# EAGLE design hbridge (EAGLE 5.11)
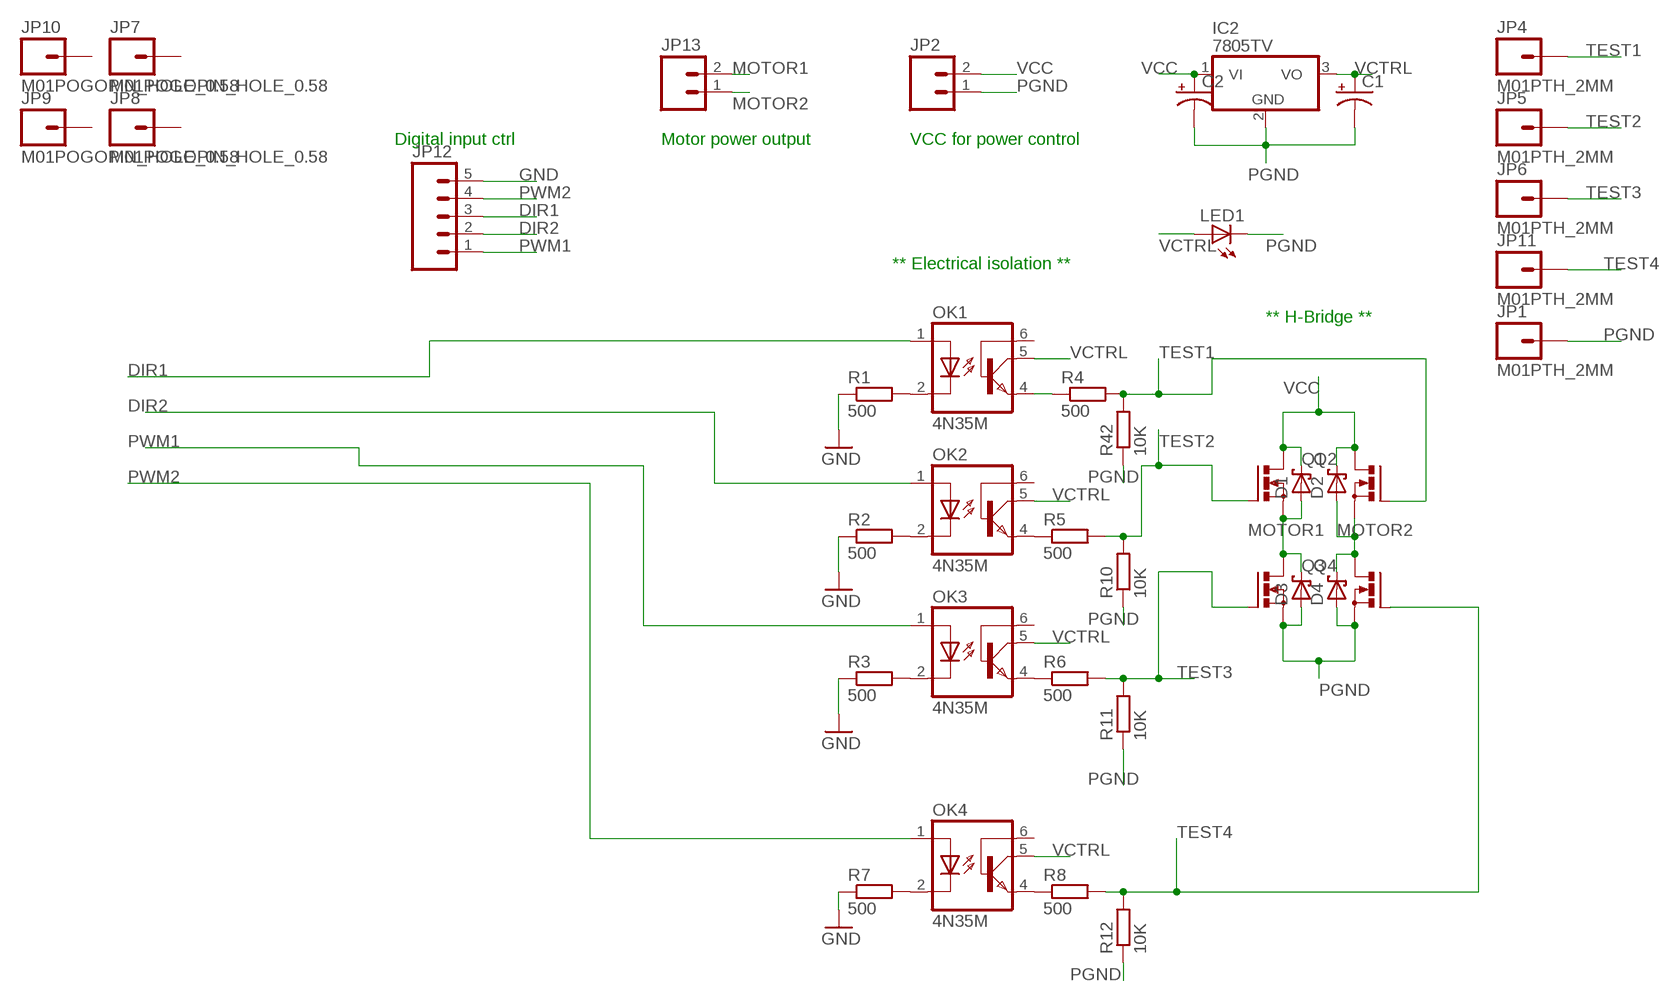
[diagram p0: schematic, sheet 1]

## Parts
C1  CAP_POLPTH2  [CPOL-RADIAL-10UF-25V]
C2  CAP_POLPTH1  [CPOL-RADIAL-100UF-25V]
D1  SCHOTTKY-DIODECB417-15  [CB417-15]
D2  SCHOTTKY-DIODECB417-15  [CB417-15]
D3  SCHOTTKY-DIODECB417-15  [CB417-15]
D4  SCHOTTKY-DIODECB417-15  [CB417-15]
IC2  7805TV  [TO220V]
JP1  M01PTH_2MM  [1X01_2MM]
JP2  M025MM  [SCREWTERMINAL-5MM-2]
JP4  M01PTH_2MM  [1X01_2MM]
JP5  M01PTH_2MM  [1X01_2MM]
JP6  M01PTH_2MM  [1X01_2MM]
JP7  M01POGOPIN_HOLE_0.58  [1X01_POGOPIN_HOLE_0.58]
JP8  M01POGOPIN_HOLE_0.58  [1X01_POGOPIN_HOLE_0.58]
JP9  M01POGOPIN_HOLE_0.58  [1X01_POGOPIN_HOLE_0.58]
JP10  M01POGOPIN_HOLE_0.58  [1X01_POGOPIN_HOLE_0.58]
JP11  M01PTH_2MM  [1X01_2MM]
JP12  M05PTH_LONGPADS  [1X05_LONGPADS]
JP13  M025MM  [SCREWTERMINAL-5MM-2]
LED1  LED5MM  [LED5MM]
OK1  4N35M  [DIL06]
OK2  4N35M  [DIL06]
OK3  4N35M  [DIL06]
OK4  4N35M  [DIL06]
Q1  PMOSFET_NTO220BV  [TO220BV]
Q2  PMOSFET_NTO220BV  [TO220BV]
Q3  PMOSFET_NTO220BV  [TO220BV]
Q4  PMOSFET_NTO220BV  [TO220BV]
R1  500  R-EU_0309/12  [0309/12]
R2  500  R-EU_0309/12  [0309/12]
R3  500  R-EU_0309/12  [0309/12]
R4  500  R-EU_0309/12  [0309/12]
R5  500  R-EU_0309/12  [0309/12]
R6  500  R-EU_0309/12  [0309/12]
R7  500  R-EU_0309/12  [0309/12]
R8  500  R-EU_0309/12  [0309/12]
R10  10K  R-EU_0309/12  [0309/12]
R11  10K  R-EU_0309/12  [0309/12]
R12  10K  R-EU_0309/12  [0309/12]
R42  10K  R-EU_0309/12  [0309/12]

## Nets
DIR1: JP12.3 OK1.1(A)
DIR2: JP12.2 OK2.1(A)
GND: JP12.5 R1.1 R2.1 R3.1 R7.1
MOTOR1: D1.A D3.C JP13.2 Q1.S Q3.D
MOTOR2: D2.A D4.C JP13.1 Q2.S Q4.D
N$1: OK1.2(C) R1.2
N$3: OK2.2(C) R2.2
N$4: OK1.4(EMI) R4.1
N$5: OK3.2(C) R3.2
N$8: OK4.2(C) R7.2
N$9: OK2.4(EMI) R5.1
N$10: OK3.4(EMI) R6.1
N$11: OK4.4(EMI) R8.1
PGND: C1.2(-) C2.2(-) D3.A D4.A IC2.2(GND) JP1.1 JP2.1 LED1.K(C) Q3.S Q4.S R10.1 R11.1 R12.1 R42.1
PWM1: JP12.1 OK3.1(A)
PWM2: JP12.4 OK4.1(A)
TEST1: JP4.1 Q2.G R4.2 R42.2
TEST2: JP5.1 Q1.G R5.2 R10.2
TEST3: JP6.1 Q3.G R6.2 R11.2
TEST4: JP11.1 Q4.G R8.2 R12.2
VCC: C2.1(+) D1.C D2.C IC2.1(VI) JP2.2 Q1.D Q2.D
VCTRL: C1.1(+) IC2.3(VO) LED1.A OK1.5(COL) OK2.5(COL) OK3.5(COL) OK4.5(COL)
Unconnected: JP7.1 JP8.1 JP9.1 JP10.1 OK1.6(BAS) OK2.6(BAS) OK3.6(BAS) OK4.6(BAS)

## Notes on the sheet
- Digital input ctrl | Motor power output | VCC for power control
- ** Electrical isolation **
- ** H-Bridge **

## Library data of the parts
C1 C2 = SparkFun:CAP_POL: Capacitor Polarized These are standard SMD and PTH capacitors. Normally 10uF, 47uF, and 100uF in electrolytic and tantalum varieties. Always verify the external diameter of the through hole cap, it varies with capacity, voltage, and manufacturer. The EIA devices should be standard.
D1-D4 = adafruit:SCHOTTKY-DIODE: Schottky Diode
IC2 = linear:78*: Positive VOLTAGE REGULATOR Source: http://cache.national.com/ds/LM/LM78L05.pdf http://www.fairchildsemi.com/ds/LM/LM7805.pdf
JP1 JP4-JP11 = SparkFun:M01: Header 1 Standard 1-pin 0.1" header. Use with straight break away headers (SKU : PRT-00116), right angle break away headers (PRT-00553), swiss pins (PRT-00743), machine pins (PRT-00117), and female headers (PRT-00115).
JP2 JP13 = SparkFun:M02: Header 2 Standard 2-pin 0.1" header. Use with straight break away headers (SKU : PRT-00116), right angle break away headers (PRT-00553), swiss pins (PRT-00743), machine pins (PRT-00117), and female headers (PRT-00115). Molex polarized connector foot print use with SKU : PRT-08233 with associated crimp pins and housings.
JP12 = SparkFun:M05: Header 5 Standard 5-pin 0.1" header. Use with straight break away headers (SKU : PRT-00116), right angle break away headers (PRT-00553), swiss pins (PRT-00743), machine pins (PRT-00117), and female headers (PRT-00115). Molex polarized connector foot print use with SKU : PRT-08230 with associated crimp pins and housings.
LED1 = SparkFun:LED: LEDs Standard schematic elements and footprints for 5mm, 3mm, 1206, and 0603 sized LEDs. 5mm - Spark Fun Electronics SKU : COM-00529 (and others)
OK1-OK4 = optocoupler:4N*?M: General Purpose 6-Pin Phototransistor Optocouplers Source: http://www.fairchildsemi.com/ds/4N/4N35-M.pdf; MPN: 4N35-M; OC_FARNELL: 1021351; OC_NEWARK: 98K9114
Q1-Q4 = transistor-power:PMOSFET_N: Power MOSFET N-Channel
R1-R8 R10-R12 R42 = rcl:R-EU_: RESISTOR, European symbol

## Board
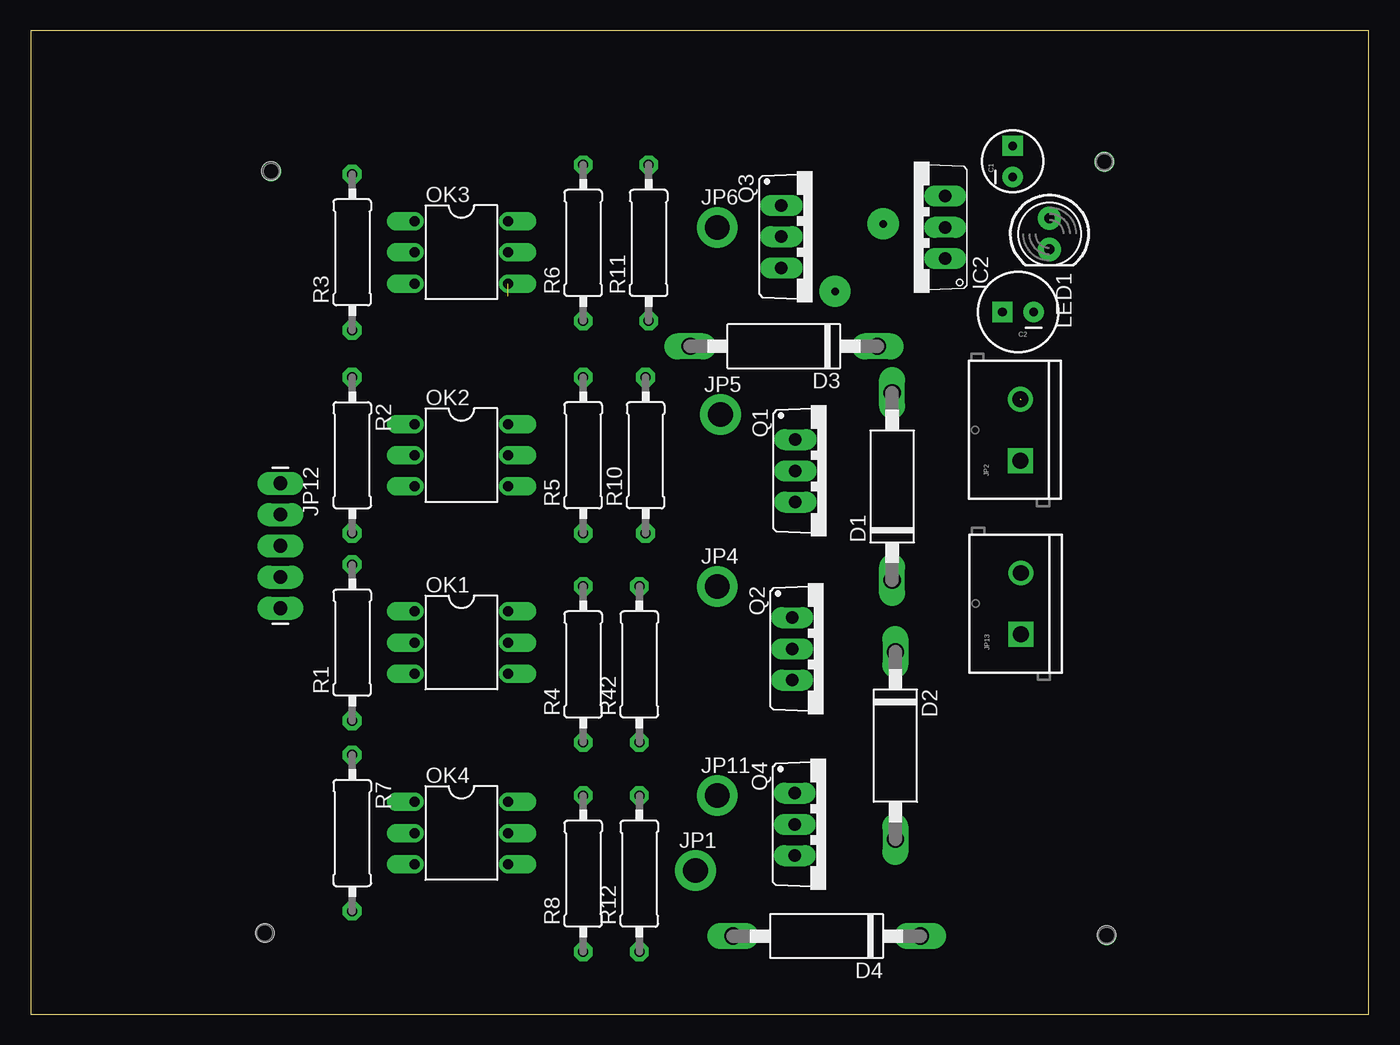
[diagram p1: board, top side]
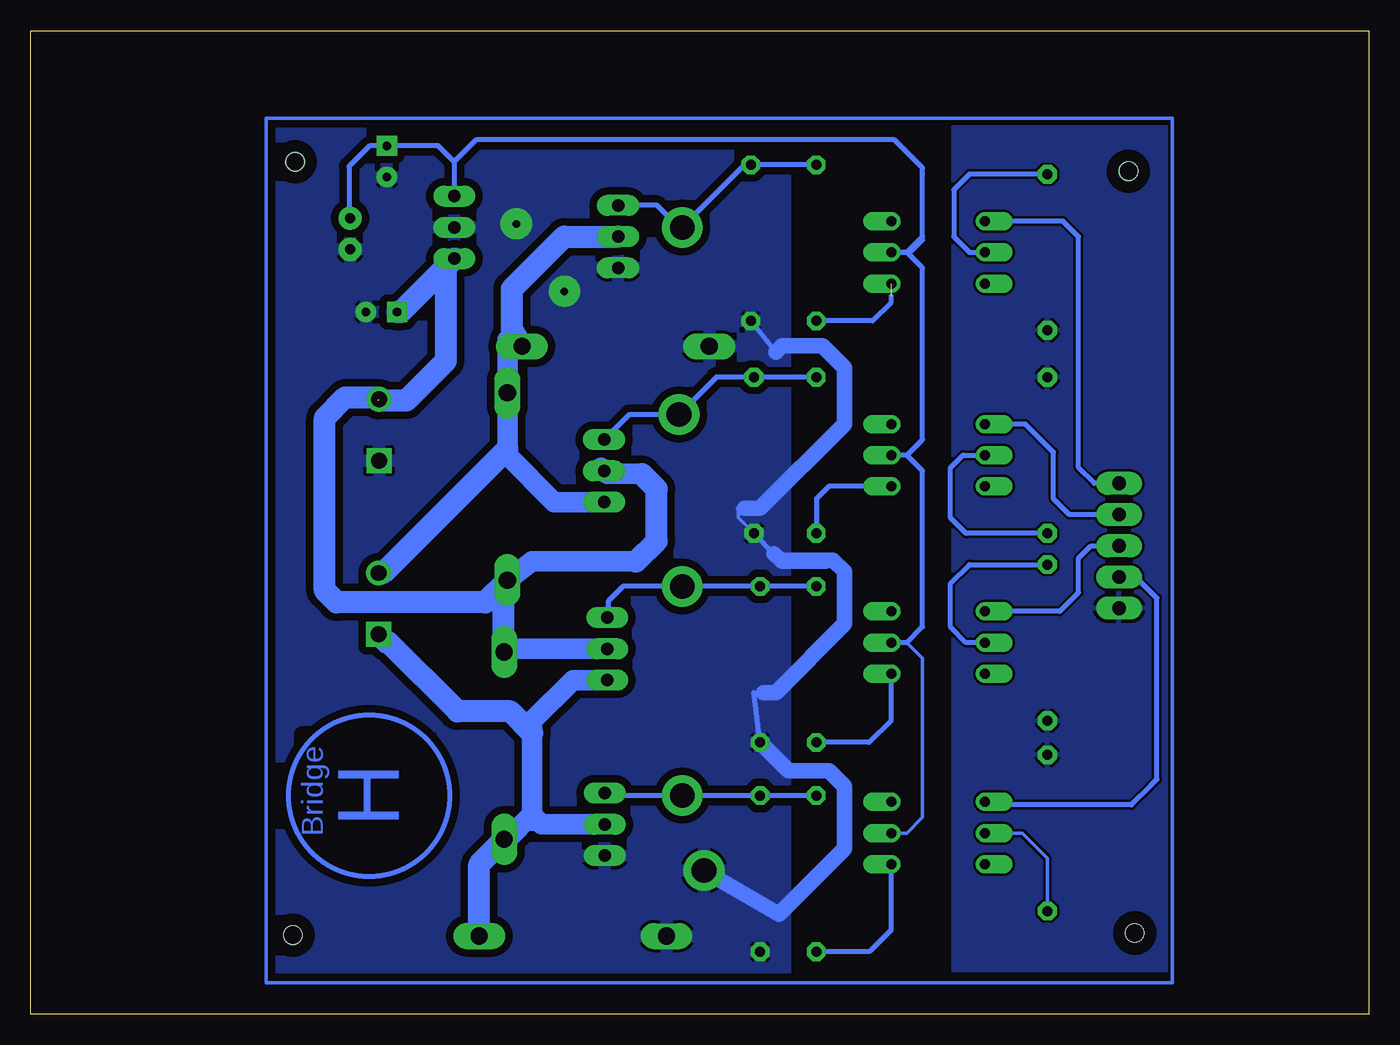
[diagram p2: board, bottom side, seen from below]

Size 108.89 x 80 mm. Coordinates in mm from the lower left corner, seen from the top.
Outline: 0,0 108.89,0 108.89,80 0,80 0,0
Copper layers (1*16): Top 0.035mm / dielectric 1.5mm / Bottom 0.035mm
Design rules "default *": minimum track width 10mil, minimum drill 24mil, track to track 8mil, track to pad 8mil, pad to pad 8mil, via to via 8mil, smd to smd 8mil, copper to edge 40mil, drill to drill 8mil, minimum pad ring 14mil, minimum via ring 8mil, stop-mask expansion 4mil, vias tented up to drill 0mil, thermal gap 10mil

### Footprints (pad centres in the part's own frame; a part is rotated, then mirrored left to right if it is on the bottom)
CPOL-RADIAL-10UF-25V = drill 0.7 pad 1.651 square: 1 1.27,0 | drill 0.7 pad 1.651 round: 2 -1.27,0
CPOL-RADIAL-100UF-25V = drill 0.7 pad 1.651 square: 1 1.27,0 | drill 0.7 pad 1.651 round: 2 -1.27,0
CB417-15 = drill 1.397 long: A 7.62,0; C -7.62,0
TO220V = drill 1.016 long: 1 -2.54,-2.54; 2 0,-2.54; 3 2.54,-2.54
1X01_2MM = drill 2 pad 3.302 round: 1 0,0
SCREWTERMINAL-5MM-2 = drill 1.3 pad 2.032 square: 1 0,0 | drill 1.3 pad 2.032 round: 2 5,0
1X01_POGOPIN_HOLE_0.58 = drill 0.9 pad 0.813 round: 1 0,0 | hole 1.473: 0,0
1X05_LONGPADS = drill 1.118 pad 1.88 long: 1 0,0; 2 2.54,0; 3 5.08,0; 4 7.62,0; 5 10.16,0
LED5MM = drill 0.813 pad 1.88 round: A -1.27,0; K 1.27,0
DIL06 = drill 0.813 offset: 1 -2.54,-3.81; 2 0,-3.81; 3 2.54,-3.81; 4 2.54,3.81; 5 0,3.81; 6 -2.54,3.81
TO220BV = drill 1.016 long: D 0,-2.54; G -2.54,-2.54; S 2.54,-2.54
0309/12 = drill 0.813 octagon: 1 -6.35,0; 2 6.35,0

### Placement (x,y rotation side)
C1  79.91,69.37 90 top
C2  80.34,57.12 180 top
D1  70.1,42.93 90 top
D2  70.36,21.84 270 top
D3  61.29,54.33 180 top
D4  64.77,6.35 180 top
IC2  71.88,64.01 90 top
JP1  54.1,11.68 0 top
JP2  80.54,45.03 90 top
JP4  55.88,34.8 0 top
JP5  56.13,48.77 0 top
JP6  55.88,64.01 0 top
JP7  87.55,6.43 0 top
JP8  19.56,68.58 0 top
JP9  19.05,6.6 0 top
JP10  87.38,69.34 0 top
JP11  55.88,17.78 0 top
JP12  20.32,43.18 270 top
JP13  80.59,30.89 90 top
LED1  82.91,63.47 270 top
OK1  35.05,30.23 270 top
OK2  35.05,45.47 270 top
OK3  35.05,61.98 270 top
OK4  35.05,14.73 270 top
Q1  64.77,44.2 270 top
Q2  64.52,29.72 270 top
Q3  63.63,63.25 270 top
Q4  64.72,15.44 270 top
R1  26.16,30.23 90 top
R2  26.16,45.47 270 top
R3  26.16,61.98 90 top
R4  44.96,28.45 90 top
R5  44.96,45.47 90 top
R6  44.96,62.74 90 top
R7  26.16,14.73 270 top
R8  44.96,11.43 90 top
R10  50.04,45.47 90 top
R11  50.29,62.74 90 top
R12  49.53,11.43 90 top
R42  49.53,28.45 90 top

### Tracks (layer width: path | path; a pad name or v marks a point on that pad's centre or on a via)
DIR1
  Bottom 0.406: OK1.1 25.15,32.77 23.62,34.29 23.62,37.08 22.61,38.1 JP12.3
DIR2
  Bottom 0.406: OK2.1 27.94,48.01 25.65,45.72 25.65,41.91 24.38,40.64 JP12.2
GND
  pour Bottom: 16,72.14 16,3.56 33.78,3.56 33.78,72.14
MOTOR1
  Bottom 1.676: Q1.S 66.29,41.66 70.1,45.47 70.1,46 D1.A 70.1,54.86 D3.C
  Bottom 1.778: D3.C 69.72,55.75 69.72,59 65.48,63.25 Q3.D | JP13.2 80.22,35.89 70.1,46
MOTOR2
  Bottom 1.676: 68.07,16.26 68.07,16.2 | 68.07,16.2 68.07,15.75 67.82,15.75 | 68.07,16.26 68.07,22.86 68.07,23.88 64.77,27.18 Q2.S | D2.A 70.1,14.22 68.07,16.26 | Q4.D 67.31,15.44 68.07,16.2
  Bottom 1.778: D2.A 72.39,12.19 D4.C | JP13.1 79.93,30.23 79.76,30.23 74.17,24.64 69.85,24.64 68.07,22.86
N$1
  Bottom 0.406: OK1.2 32.77,30.23 34.04,31.5 34.04,35.05 32.51,36.58 R1.2
N$2
  Bottom 0.305: 16,2.54 16,72.9 84.73,72.9 84.84,72.9 89.74,72.9 89.74,72.82 89.74,72.36 89.74,2.54 16,2.54
N$3
  Bottom 0.406: R2.2 32.77,39.12 34.04,40.39 34.04,44.45 33.02,45.47 OK2.2 30.48,45.47
N$4
  Bottom 0.406: R4.1 40.64,22.1 38.86,23.88 OK1.4
N$5
  Bottom 0.406: R3.2 32.51,68.33 33.78,67.06 33.78,63.25 32.51,61.98 OK3.2
N$8
  Bottom 0.3: R7.2 26.16,12.7 28.19,14.73 OK4.2
N$9
  Bottom 0.406: OK2.4 43.94,42.93 44.96,41.91 R5.1
N$10  (1 unrouted)
  Bottom 0.406: 38.86,58.42 38.86,57.91 40.39,56.39 R6.1
N$11
  Bottom 0.3: OK4.4 39.12,11.94
  Bottom 0.406: R8.1 40.64,5.08 38.86,6.86 OK4.4
PGND  (via drill 0.6 pad 2.54)
  Bottom 0.305: 50.04,26.16 49.53,26.16 | 51.31,41.15 51.31,40.39 R10.1
  Bottom 0.406: R42.1 50.04,26.16 | 48.39,37.47 R10.1 50.04,39.62 | 48.26,53.85 R11.1 | 49.53,26.16 49.28,26.16 | 51.31,41.15 50.8,41.15
  Bottom 1.27: 50.8,41.15 49.53,41.15 42.67,48.01 42.67,52.58 44.45,54.36 47.75,54.36 48.26,53.85 | 49.28,26.16 48.26,26.16 42.67,31.75 42.67,36.02 43.59,36.93 47.85,36.93 | 44.2,36.83 47.75,36.83 47.85,36.93 | JP1.1 48.01,8.13 42.67,13.46 42.67,18.54 43.94,19.81 47.24,19.81 R42.1 | 47.85,36.93 48.39,37.47
  other vias: 65.46,58.8 69.37,64.29
  pour Bottom (isolate 0.61): 88.72,72.39 88.72,3.3 47.5,3.3 47.5,72.14
PWM1
  Bottom 0.406: OK3.1 24.89,64.52 23.62,63.25 23.62,44.45 22.35,43.18 JP12.1
PWM2
  Bottom 0.406: OK4.1 30.99,17.02 19.3,17.02 17.78,18.54 17.78,18.57 17.25,19.1 17.25,33.83 18.97,35.56 JP12.4
TEST1
  Bottom 0.406: R4.2 R42.2 JP4.1 60.68,34.8 61.9,33.58 61.9,32.33 Q2.G
TEST2
  Bottom 0.406: Q1.G 60.2,48.77 JP5.1 55.24,49.66 54.36,50.55 53.09,51.82 R10.2 R5.2
TEST3
  Bottom 0.406: R6.2 R11.2 50.8,69.09 JP6.1 56.13,64.01 57.91,65.79 Q3.G
TEST4
  Bottom 0.406: R8.2 R12.2 JP11.1 61.98,17.78 Q4.G
VCC  (1 unrouted)
  Bottom 1.676: 62.48,44.45 Q1.D 61.98,43.94 59.18,43.94 | Q2.D 70.1,29.72 D2.C 70.36,33.02 | 59.69,36.83 68.07,36.83 D1.C
  Bottom 1.778: D2.C 70.41,29.52 70.41,33.76 70.1,34.06 D1.C 71.91,33.5 84,33.5 84.96,34.47 84.96,48.49 83.29,50.16 80.85,50.16 80.62,49.94 78.31,49.94 75.11,53.14 75.11,60.78 IC2.1 78.77,57.12 C2.1 | JP2.2 80.5,49.99 | 59.69,36.83 59.61,36.83 57.96,38.48 57.96,42.72 59.18,43.94
VCTRL
  Bottom 0.3: 37.59,30.23 36.32,28.96 36.32,16 37.59,14.73 OK4.5
  Bottom 0.406: OK1.5 37.59,30.23 36.32,31.5 36.32,44.2 37.59,45.47 | 37.59,45.47 OK2.5 | 37.59,45.47 36.32,46.74 36.32,60.71 37.59,61.98 | 37.59,61.98 OK3.5 37.34,61.98 36.32,62.99 36.32,68.83 38.61,71.12 72.64,71.12 74.42,69.34 | 37.59,61.98 36.32,63.25 36.32,68.33 | 74.42,69.34 IC2.3 74.68,66.8 | LED1.A 82.98,64.82 82.98,68.96 81.31,70.64 C1.1 79.88,70.66 75.74,70.66 74.42,69.34
(copper drawn outside any net)
  shapes: Bottom circle x1

### Text on the board
Top: ******** TODO ******** | footprint size | excitation gate mosfet
Bottom: H | Bridge